# Altium project AMC_FMC_Carrier.PrjPcb (part 1 of 9)
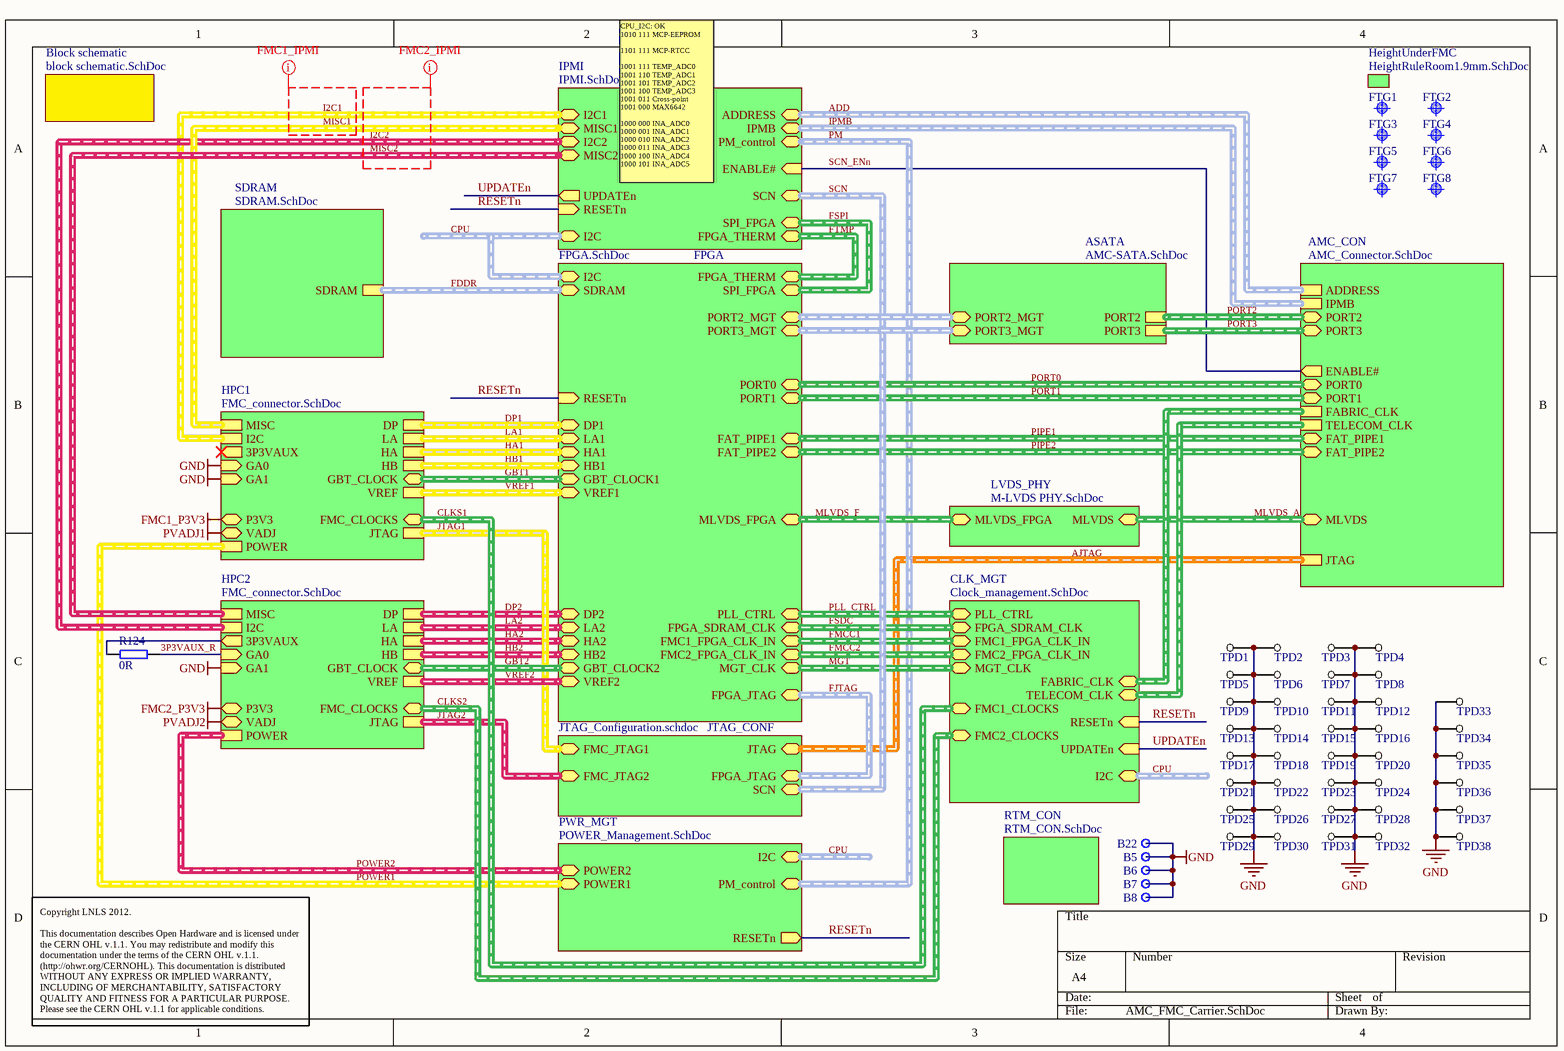
[diagram p0: AMC_FMC_Carrier.SchDoc]
25 sheets, 1216 parts. Net scope: hierarchical (ports join the sheet entries above them; power ports are global).
Board file: AMC_FMC_Carrier_35u_tears.PcbDoc
Sheets:
  AMC_FMC_Carrier.SchDoc
    HPC1 = FMC_connector.SchDoc
    HPC2 = FMC_connector.SchDoc
    FPGA = FPGA.SchDoc
      FSDRAM = FPGA_SDRAM.SchDoc
      FHPC1 = FMC_HPC1.SchDoc
      FHPC2 = FMC_HPC2.SchDoc
      FMGT = FPGA_MGT.SchDoc
      FPGA_SUP = FPGA_SUP.SchDoc
    SDRAM = SDRAM.SchDoc
    IPMI = IPMI.SchDoc
      CPU = CPU.SchDoc
      UUART = USB_UART.SchDoc
    JTAG_CONF = JTAG_Configuration.SchDoc
    LVDS_PHY = M-LVDS PHY.SchDoc
    CLK_MGT = Clock_management.SchDoc
      CLK_WR = Clock_WR.SchDoc
      FCLK = FMC_Clocks.SchDoc
    ASATA = AMC-SATA.SchDoc
    Block schematic = block schematic.SchDoc
    HeightUnderFMC = HeightRuleRoom1.9mm.SchDoc
  SUP_1.2_1.8.SchDoc
  SUP_3.3_FMC.SchDoc
  SUP_1V.SchDoc
  SUP_2.5_FMC.SchDoc
  UI_mon.SchDoc

## Sheet AMC_FMC_Carrier.SchDoc
size A4; DocumentNumber: 2; SheetNumber: 2; SheetTotal: 30

### Parts
B5  Test Point  [VERO_20-2136]  (value not drawn)
B6  Test Point  [VERO_20-2136]  (value not drawn)
B7  Test Point  [VERO_20-2136]  (value not drawn)
B8  Test Point  [VERO_20-2136]  (value not drawn)
B22  Test Point  [VERO_20-2136]  (value not drawn)
FTG1  Use only in PCB  [FIDUCIAL_TOP_S100-200]  (value not drawn)
FTG2  Use only in PCB  [FIDUCIAL_TOP_C100-200]  (value not drawn)
FTG3  Use only in PCB  [FIDUCIAL_TOP_S100-200]  (value not drawn)
FTG4  Use only in PCB  [FIDUCIAL_TOP_C100-200]  (value not drawn)
FTG5  Use only in PCB  [FIDUCIAL_TOP_S100-200]  (value not drawn)
FTG6  Use only in PCB  [FIDUCIAL_TOP_C100-200]  (value not drawn)
FTG7  Use only in PCB  [FIDUCIAL_TOP_S100-200]  (value not drawn)
FTG8  Use only in PCB  [FIDUCIAL_TOP_C100-200]  (value not drawn)
R124  0R  [0402R]
TPD1  Test Point  [TP_DIFF_0805]  (value not drawn)
TPD2  Test Point  [TP_DIFF_0805]  (value not drawn)
TPD3  Test Point  [TP_DIFF_0805]  (value not drawn)
TPD4  Test Point  [TP_DIFF_0805]  (value not drawn)
TPD5  Test Point  [TP_DIFF_0805]  (value not drawn)
TPD6  Test Point  [TP_DIFF_0805]  (value not drawn)
TPD7  Test Point  [TP_DIFF_0805]  (value not drawn)
TPD8  Test Point  [TP_DIFF_0805]  (value not drawn)
TPD9  Test Point  [TP_DIFF_0805]  (value not drawn)
TPD10  Test Point  [TP_DIFF_0805]  (value not drawn)
TPD11  Test Point  [TP_DIFF_0805]  (value not drawn)
TPD12  Test Point  [TP_DIFF_0805]  (value not drawn)
TPD13  Test Point  [TP_DIFF_0805]  (value not drawn)
TPD14  Test Point  [TP_DIFF_0805]  (value not drawn)
TPD15  Test Point  [TP_DIFF_0805]  (value not drawn)
TPD16  Test Point  [TP_DIFF_0805]  (value not drawn)
TPD17  Test Point  [TP_DIFF_0805]  (value not drawn)
TPD18  Test Point  [TP_DIFF_0805]  (value not drawn)
TPD19  Test Point  [TP_DIFF_0805]  (value not drawn)
TPD20  Test Point  [TP_DIFF_0805]  (value not drawn)
TPD21  Test Point  [TP_DIFF_0805]  (value not drawn)
TPD22  Test Point  [TP_DIFF_0805]  (value not drawn)
TPD23  Test Point  [TP_DIFF_0805]  (value not drawn)
TPD24  Test Point  [TP_DIFF_0805]  (value not drawn)
TPD25  Test Point  [TP_DIFF_0805]  (value not drawn)
TPD26  Test Point  [TP_DIFF_0805]  (value not drawn)
TPD27  Test Point  [TP_DIFF_0805]  (value not drawn)
TPD28  Test Point  [TP_DIFF_0805]  (value not drawn)
TPD29  Test Point  [TP_DIFF_0805]  (value not drawn)
TPD30  Test Point  [TP_DIFF_0805]  (value not drawn)
TPD31  Test Point  [TP_DIFF_0805]  (value not drawn)
TPD32  Test Point  [TP_DIFF_0805]  (value not drawn)
TPD33  Test Point  [TP_DIFF_0805]  (value not drawn)
TPD34  Test Point  [TP_DIFF_0805]  (value not drawn)
TPD35  Test Point  [TP_DIFF_0805]  (value not drawn)
TPD36  Test Point  [TP_DIFF_0805]  (value not drawn)
TPD37  Test Point  [TP_DIFF_0805]  (value not drawn)
TPD38  Test Point  [TP_DIFF_0805]  (value not drawn)

### Sub-sheets
AMC_CON = AMC_Connector.SchDoc (file not in this document): JTAG (harness AMC_JTAG), TELECOM_CLK (harness AMC_TELECOM_CLOCK), ADDRESS (harness AMC_ADD), FABRIC_CLK (harness AMC_FABRIC_CLOCK), IPMB (harness I2C), ENABLE# (out), PORT0 (harness PORT0), PORT1 (harness PORT1), PORT2 (harness PORT2), PORT3 (harness PORT3), FAT_PIPE1 (harness FAT_PIPE1), FAT_PIPE2 (harness FAT_PIPE2), MLVDS (harness MLVDS)
ASATA = AMC-SATA.SchDoc: PORT2 (harness PORT2), PORT3 (harness PORT3), PORT2_MGT (harness PORT2), PORT3_MGT (harness PORT3)
Block schematic = block schematic.SchDoc: no entries
CLK_MGT = Clock_management.SchDoc: FABRIC_CLK (harness AMC_FABRIC_CLOCK), TELECOM_CLK (harness AMC_TELECOM_CLOCK), FMC1_CLOCKS (harness FMC_CLOCKS), FMC2_CLOCKS (harness FMC_CLOCKS), MGT_CLK (harness MGT_CLK), FMC1_FPGA_CLK_IN (harness FMC_FPGA_CLK_IN), FMC2_FPGA_CLK_IN (harness FMC_FPGA_CLK_IN), FPGA_SDRAM_CLK (harness FPGA_SDRAM_CLK), PLL_CTRL (harness PLL_CTRL), RESETn (in), UPDATEn (in), I2C (harness I2C)
FPGA = FPGA.SchDoc: SDRAM (harness DDR), FPGA_JTAG (harness FMC_J1_JTAG), VREF2 (harness FMC_J1_VREF), VREF1 (harness FMC_J1_VREF), FPGA_THERM (harness FPGA_THERM), SPI_FPGA (harness SPI), FAT_PIPE1, FAT_PIPE2, PORT1, PORT0, MLVDS_FPGA, GBT_CLOCK1, GBT_CLOCK2, MGT_CLK, FMC1_FPGA_CLK_IN, FMC2_FPGA_CLK_IN, FPGA_SDRAM_CLK, PLL_CTRL (harness PLL_CTRL), RESETn (in), I2C (harness I2C), LA1, HA1, HB1, LA2, HA2, HB2, DP1, DP2, PORT2_MGT, PORT3_MGT
HeightUnderFMC = HeightRuleRoom1.9mm.SchDoc: no entries
HPC1 = FMC_connector.SchDoc: DP (harness FMC_J1_DP), LA (harness FMC_J1_LA), HA (harness FMC_J1_HA), HB (harness FMC_J1_HB), MISC (harness MISC), POWER (harness FMC_J1_POWER), JTAG (harness FMC_J1_JTAG), I2C (harness I2C), GA0 (in), GA1 (in), 3P3VAUX (out), VREF (harness FMC_J1_VREF), FMC_CLOCKS (harness FMC_CLOCKS), GBT_CLOCK (harness GBT_CLOCK), VADJ, P3V3
HPC2 = FMC_connector.SchDoc: DP (harness FMC_J1_DP), LA (harness FMC_J1_LA), HA (harness FMC_J1_HA), HB (harness FMC_J1_HB), MISC (harness MISC), POWER (harness FMC_J1_POWER), JTAG (harness FMC_J1_JTAG), I2C (harness I2C), VREF (harness FMC_J1_VREF), GA0 (in), GA1 (in), 3P3VAUX (out), FMC_CLOCKS (harness FMC_CLOCKS), GBT_CLOCK (harness GBT_CLOCK), VADJ, P3V3
IPMI = IPMI.SchDoc: I2C1 (harness I2C), I2C2 (harness I2C), IPMB (harness I2C), ADDRESS (harness AMC_ADD), MISC1 (harness MISC), MISC2 (harness MISC), PM_control (harness pm_control), FPGA_THERM (harness FPGA_THERM), SPI_FPGA (harness SPI), ENABLE# (in), UPDATEn (out), RESETn (in), I2C (harness I2C), SCN (harness SCN)
JTAG_CONF = JTAG_Configuration.schdoc: FMC_JTAG1 (harness FMC_J1_JTAG), FMC_JTAG2 (harness FMC_J1_JTAG), JTAG (harness AMC_JTAG), FPGA_JTAG (harness FMC_J1_JTAG), SCN (harness SCN)
LVDS_PHY = M-LVDS PHY.SchDoc: MLVDS (harness MLVDS), MLVDS_FPGA (harness MLVDS-FPGA)
PWR_MGT = POWER_Management.SchDoc (file not in this document): POWER1 (harness FMC_J1_POWER), POWER2 (harness FMC_J1_POWER), PM_control (harness PM_control), RESETn (out), I2C (harness I2C)
RTM_CON = RTM_CON.SchDoc (file not in this document): no entries
SDRAM = SDRAM.SchDoc: SDRAM (harness DDR)

### Nets
GND: B5.1 B6.1 B7.1 B8.1 B22.1 TPD1.1(TP) TPD2.1(TP) TPD3.1(TP) TPD4.1(TP) TPD5.1(TP) TPD6.1(TP) TPD7.1(TP) TPD8.1(TP) TPD9.1(TP) TPD10.1(TP) TPD11.1(TP) TPD12.1(TP) TPD13.1(TP) TPD14.1(TP) TPD15.1(TP) TPD16.1(TP) TPD17.1(TP) TPD18.1(TP) TPD19.1(TP) TPD20.1(TP) TPD21.1(TP) TPD22.1(TP) TPD23.1(TP) TPD24.1(TP) TPD25.1(TP) TPD26.1(TP) TPD27.1(TP) TPD28.1(TP) TPD29.1(TP) TPD30.1(TP) TPD31.1(TP) TPD32.1(TP) TPD33.1(TP) TPD34.1(TP) TPD35.1(TP) TPD36.1(TP) TPD37.1(TP) TPD38.1(TP) ; sheet HPC1/GA0, sheet HPC1/GA1, sheet HPC2/GA1
3P3VAUX_R: R124.2 ; sheet HPC2/GA0
POWER2.3P3VAUX: R124.1 ; sheet HPC2/3P3VAUX
RESETn: sheet FPGA/RESETn, sheet PWR_MGT/RESETn, sheet IPMI/RESETn, sheet CLK_MGT/RESETn
SCN_ENn: sheet AMC_CON/ENABLE#, sheet IPMI/ENABLE#
UPDATEn: sheet IPMI/UPDATEn, sheet CLK_MGT/UPDATEn

### Buses and harness runs
harness ADD = sheet AMC_CON/ADDRESS = sheet IPMI/ADDRESS
harness AJTAG = sheet AMC_CON/JTAG = sheet JTAG_CONF/JTAG
harness CLKS1 = sheet CLK_MGT/FMC1_CLOCKS = sheet HPC1/FMC_CLOCKS
harness CLKS2 = sheet CLK_MGT/FMC2_CLOCKS = sheet HPC2/FMC_CLOCKS
harness CPU = sheet CLK_MGT/I2C
harness CPU = sheet FPGA/I2C = sheet IPMI/I2C
harness CPU = sheet PWR_MGT/I2C
harness DP1 = sheet FPGA/DP1 = sheet HPC1/DP
harness DP2 = sheet FPGA/DP2 = sheet HPC2/DP
harness FDDR = sheet FPGA/SDRAM = sheet SDRAM/SDRAM
harness FJTAG = sheet FPGA/FPGA_JTAG = sheet JTAG_CONF/FPGA_JTAG
harness FMCC1 = sheet CLK_MGT/FMC1_FPGA_CLK_IN = sheet FPGA/FMC1_FPGA_CLK_IN
harness FMCC2 = sheet CLK_MGT/FMC2_FPGA_CLK_IN = sheet FPGA/FMC2_FPGA_CLK_IN
harness FSDC = sheet CLK_MGT/FPGA_SDRAM_CLK = sheet FPGA/FPGA_SDRAM_CLK
harness FSPI = sheet FPGA/SPI_FPGA = sheet IPMI/SPI_FPGA
harness FTMP = sheet FPGA/FPGA_THERM = sheet IPMI/FPGA_THERM
harness GBT1 = sheet FPGA/GBT_CLOCK1 = sheet HPC1/GBT_CLOCK
harness GBT2 = sheet FPGA/GBT_CLOCK2 = sheet HPC2/GBT_CLOCK
harness HA1 = sheet FPGA/HA1 = sheet HPC1/HA
harness HA2 = sheet FPGA/HA2 = sheet HPC2/HA
harness HB1 = sheet FPGA/HB1 = sheet HPC1/HB
harness HB2 = sheet FPGA/HB2 = sheet HPC2/HB
harness I2C1 = sheet HPC1/I2C = sheet IPMI/I2C1
harness I2C2 = sheet HPC2/I2C = sheet IPMI/I2C2
harness IPMB = sheet AMC_CON/IPMB = sheet IPMI/IPMB
harness JTAG1 = sheet HPC1/JTAG = sheet JTAG_CONF/FMC_JTAG1
harness JTAG2 = sheet HPC2/JTAG = sheet JTAG_CONF/FMC_JTAG2
harness LA1 = sheet FPGA/LA1 = sheet HPC1/LA
harness LA2 = sheet FPGA/LA2 = sheet HPC2/LA
harness MGT = sheet CLK_MGT/MGT_CLK = sheet FPGA/MGT_CLK
harness MISC1 = sheet HPC1/MISC = sheet IPMI/MISC1
harness MISC2 = sheet HPC2/MISC = sheet IPMI/MISC2
harness MLVDS_A = sheet AMC_CON/MLVDS = sheet LVDS_PHY/MLVDS
harness MLVDS_F = sheet FPGA/MLVDS_FPGA = sheet LVDS_PHY/MLVDS_FPGA
harness PIPE1 = sheet AMC_CON/FAT_PIPE1 = sheet FPGA/FAT_PIPE1
harness PIPE2 = sheet AMC_CON/FAT_PIPE2 = sheet FPGA/FAT_PIPE2
harness PLL_CTRL = sheet CLK_MGT/PLL_CTRL = sheet FPGA/PLL_CTRL
harness PM = sheet IPMI/PM_control = sheet PWR_MGT/PM_control
harness PORT0 = sheet AMC_CON/PORT0 = sheet FPGA/PORT0
harness PORT1 = sheet AMC_CON/PORT1 = sheet FPGA/PORT1
harness PORT2 = sheet AMC_CON/PORT2 = sheet ASATA/PORT2
harness PORT3 = sheet AMC_CON/PORT3 = sheet ASATA/PORT3
harness POWER1 = sheet HPC1/POWER = sheet PWR_MGT/POWER1
harness POWER2 = sheet HPC2/POWER = sheet PWR_MGT/POWER2
harness SCN = sheet IPMI/SCN = sheet JTAG_CONF/SCN
harness sheet AMC_CON/FABRIC_CLK = sheet CLK_MGT/FABRIC_CLK
harness sheet AMC_CON/TELECOM_CLK = sheet CLK_MGT/TELECOM_CLK
harness sheet ASATA/PORT2_MGT = sheet FPGA/PORT2_MGT
harness sheet ASATA/PORT3_MGT = sheet FPGA/PORT3_MGT
harness VREF1 = sheet FPGA/VREF1 = sheet HPC1/VREF
harness VREF2 = sheet FPGA/VREF2 = sheet HPC2/VREF

### Layout directives
net class FMC1_IPMI: I2C1, MISC1
net class FMC2_IPMI: I2C2, MISC2

### Notes on the sheet
- CPU_I2C: OK
  1010 111 MCP-EEPROM
  1101 111 MCP-RTCC
  1001 111 TEMP_ADC0
  1001 110 TEMP_ADC1
  1001 101 TEMP_ADC2
  1001 100 TEMP_ADC3
  1001 011 Cross-point
  1001 000 MAX6642
  1000 000 INA_ADC0
  1000 001 INA_ADC1
  1000 010 INA_ADC2
  1000 011 INA_ADC3
  1000 100 INA_ADC4
  1000 101 INA_ADC5
- Copyright LNLS 2012.
  This documentation describes Open Hardware and is licensed under the CERN OHL v.1.1. You may redistribute and modify this documentation under the terms of the CERN OHL v.1.1. (http://ohwr.org/CERNOHL). This documentation is distributed WITHOUT ANY EXPRESS OR IMPLIED WARRANTY, INCLUDING OF MERCHANTABILITY, SATISFACTORY QUALITY AND FITNESS FOR A PARTICULAR PURPOSE. Please see the CERN OHL v.1.1 for applicable conditions.

### Library data of the parts
B5-B8 B22 = VERO_20-2136: Single Terminal Socket; Part Description: Black Bead PCB Terminal Test Pin (1.32 mm hole); Manufacturer: VERO TECHNOLOGIES; Table: Miscellaneous; Part Number: VERO_20-2136; Component Kind: Standard; Component Type: Standard; Pin Count: 1; Family: Test Point; Mounted: Yes; Socket: No; SMD: No; Status: None; Manufacturer Part Number: 20-2136; ComponentHeight: 5.3mm; HelpURL: \\cern.ch\dfs\Applications\Altium\Datasheets\VERO_20-2136.pdf; Author: CERN DEM JLC; CreateDate: 21/07/2008; LatestRevisionDate: 21/07/2008
FTG1 FTG3 FTG5 FTG7 = FIDUCIAL_TARGET_S100-200: Fiducial Target; Part Description: Square Fiducial Target, Top Layer, 1.0mm, Top Solder 2.0mm, Keepout =2.0mm; Mounted: No; Table: Pads; Part Number: FIDUCIAL_TARGET_S100-200; Component Kind: Standard (No BOM); Component Type: Standard (No BOM); Pin Count: 1; Family: Fiducial; Socket: No; SMD: Yes; Status: None; ComponentHeight: 0mm; Author: CERN DEM JLC; CreateDate: 2010-02-09; LatestRevisionDate: 2012-04-04; PackageDescription: Square Fiducial Target, Top Layer, 1.0mm, Top Solder 2.0mm, Keepout =2.0mm
FTG2 FTG4 FTG6 FTG8 = FIDUCIAL_TARGET_C100-200: Fiducial Target; Part Description: Round Fiducial Target, Top Layer, 1.0mm, Top Solder 2.0mm, Keepout =2.0mm; Mounted: No; Table: Pads; Part Number: FIDUCIAL_TARGET_C100-200; Component Kind: Standard (No BOM); Component Type: Standard (No BOM); Pin Count: 1; Family: Fiducial; Socket: No; SMD: Yes; Status: None; ComponentHeight: 0mm; Author: CERN DEM JLC; CreateDate: 2010-02-09; LatestRevisionDate: 2012-04-04; PackageDescription: Round Fiducial Target, Top Layer, 1.0mm, Top Solder 2.0mm, Keepout =2.0mm
R124 = RES_0402: SMD Resistor; Supplier 1: Newark; Supplier Part Number 1: 59M6691
TPD1-TPD38 = TP_DIFF: 1625854-2; Bottom_EstimationX (mm): 0; Document Name: AMC_FMC_Carrier.SchDoc; Part Number: TP_DIFF; ParamsList: Test Point; FootprintSizeX (mm): 4; FootprintSizeY (mm): 2; FootprintRectangleArea (mm): 8; Thickness (Max) (mm): 2; Bottom_EstimationY (mm): 0; Bottom_Area_Estimation (mm): 0; FootprintAlias: TP_SMD_0805

## Sheet FMC_connector.SchDoc
size A2; DocumentNumber: 3; SheetNumber: 3; SheetTotal: 30
Used 2 times, as channels HPC1, HPC2. Parts and nets are listed once, with the designators drawn on the sheet.
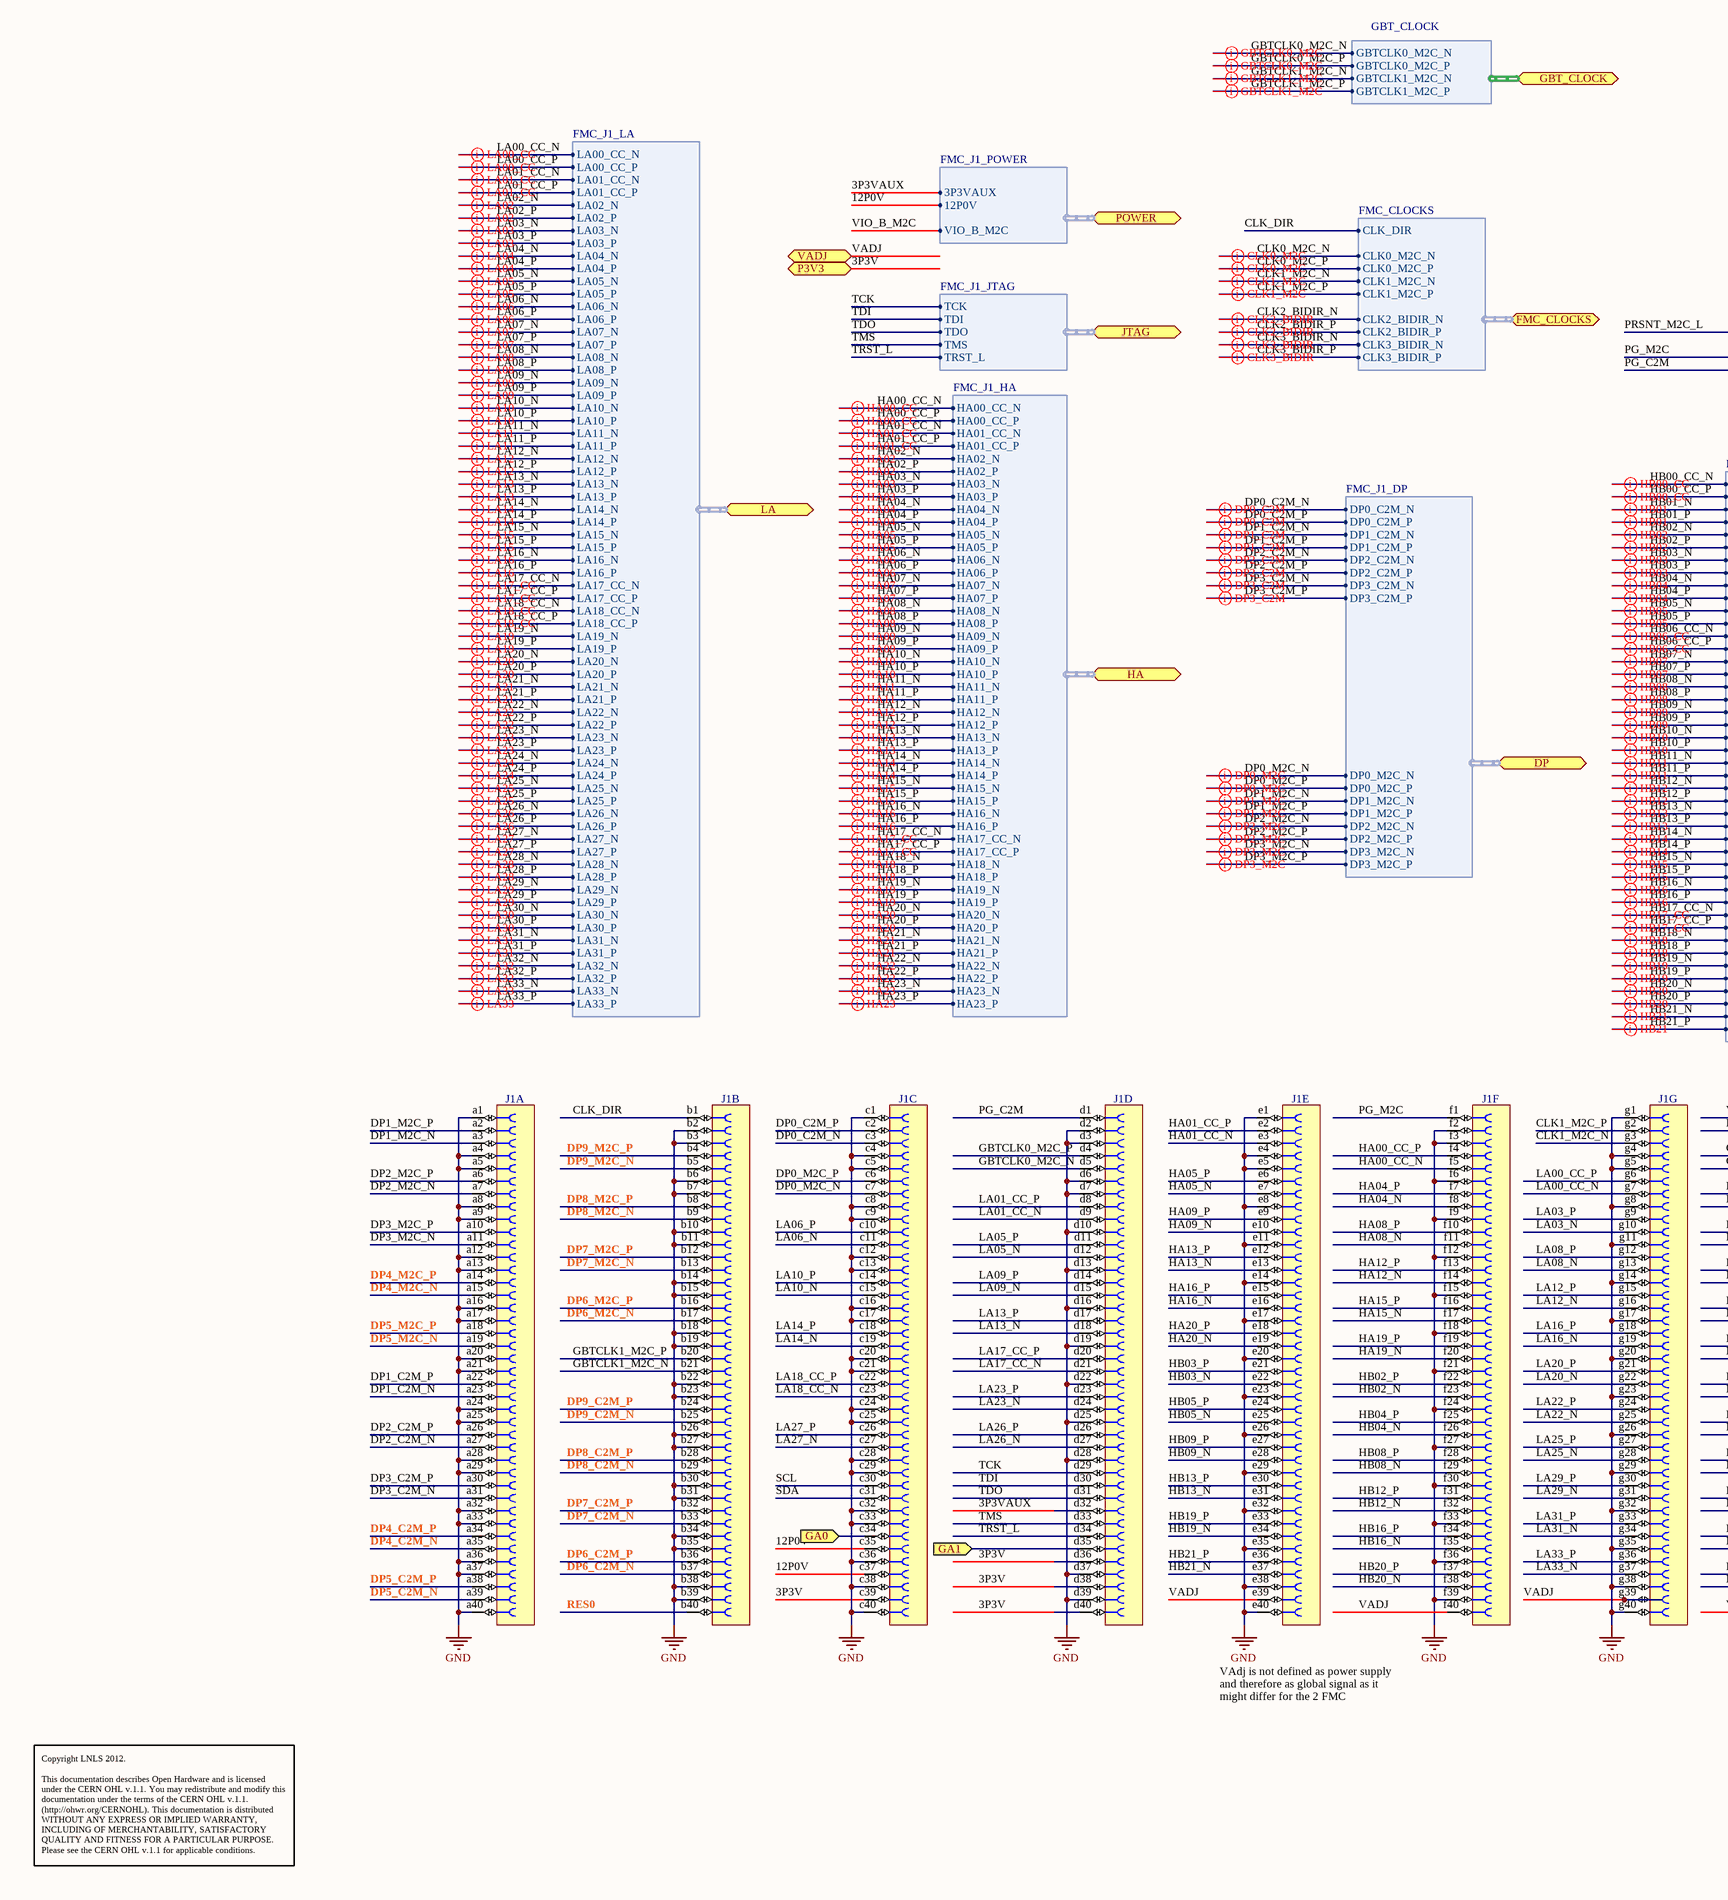
[diagram p1: FMC_connector.SchDoc, left]
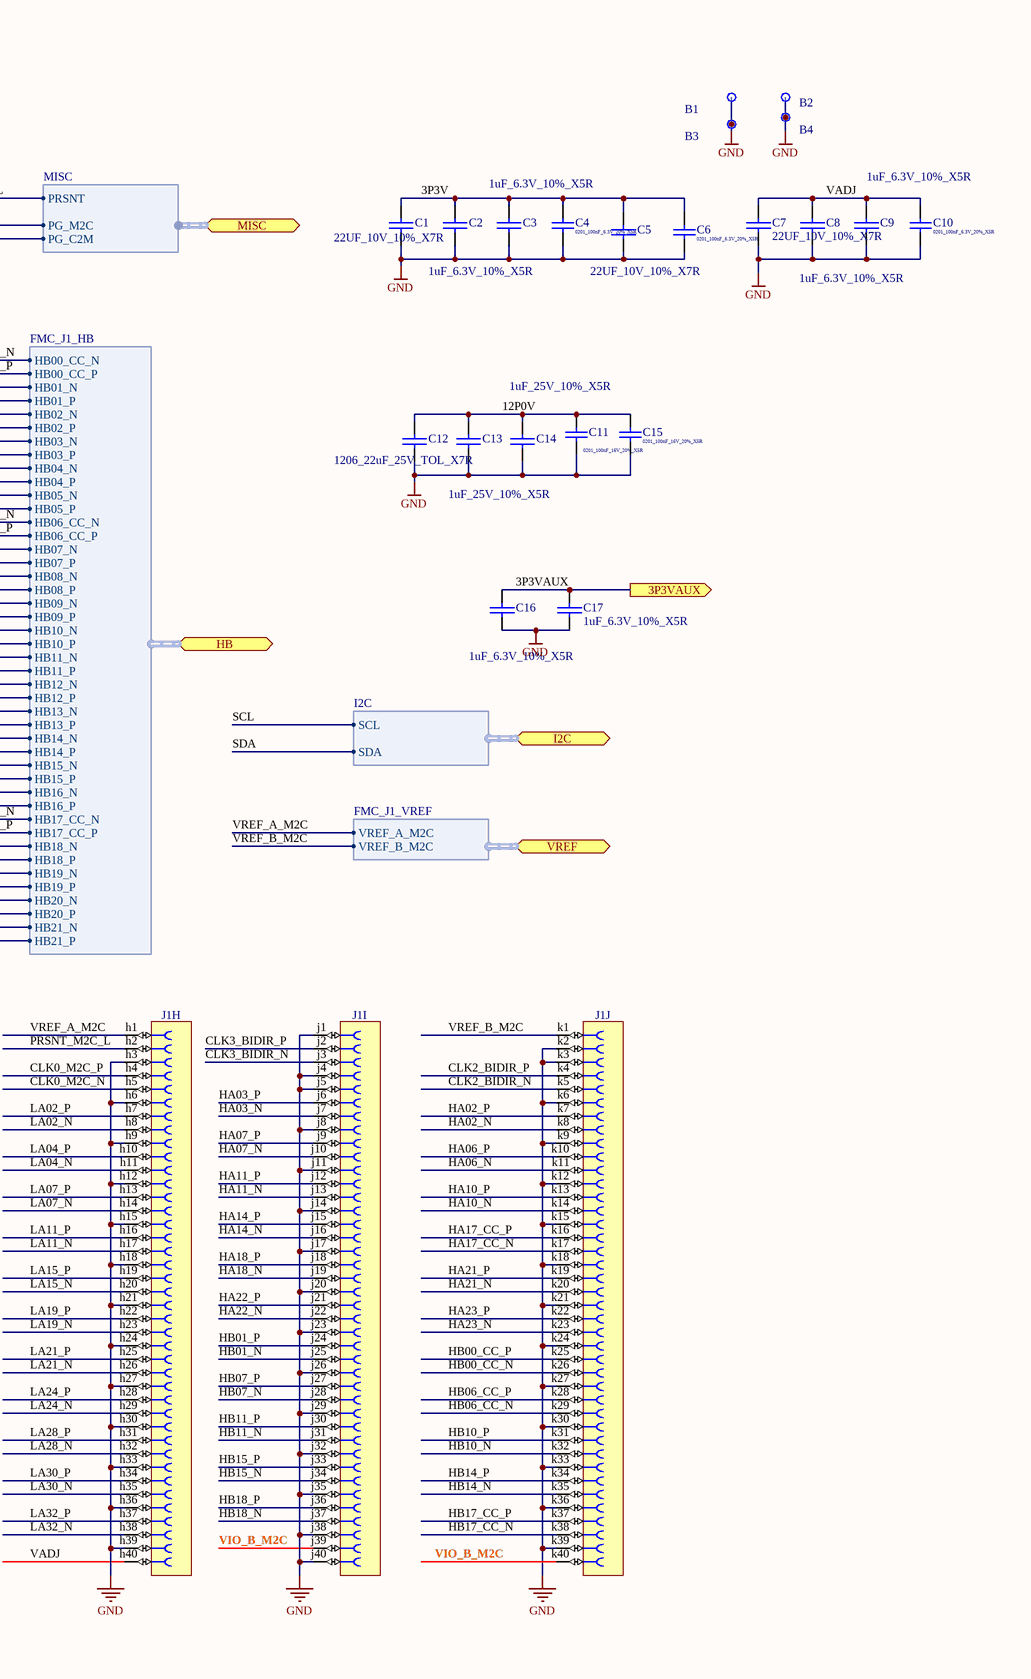
[diagram p2: FMC_connector.SchDoc, right]

### Parts
B1  Plated Hole  [MTG270_500]  (value not drawn)
B2  Plated Hole  [MTG270_500]  (value not drawn)
B3  Plated Hole  [MTG270_500]  (value not drawn)
B4  Plated Hole  [MTG270_500]  (value not drawn)
C1  22UF_10V_10%_X7R  [1206C]
C2  1uF_6.3V_10%_X5R  [0603C]
C3  1uF_6.3V_10%_X5R  [0603C]
C4  0201_100nF_6.3V_20%_X5R  [CAPC0603X33N]
C5  22UF_10V_10%_X7R  [1206C]
C6  0201_100nF_6.3V_20%_X5R  [CAPC0603X33N]
C7  22UF_10V_10%_X7R  [1206C]
C8  1uF_6.3V_10%_X5R  [0603C]
C9  1uF_6.3V_10%_X5R  [0603C]
C10  0201_100nF_6.3V_20%_X5R  [CAPC0603X33N]
C11  0201_100nF_16V_20%_X5R  [CAPC0603X33N]
C12  1206_22uF_25V_TOL_X7R  [1206C]
C13  1uF_25V_10%_X5R  [0603C]
C14  1uF_25V_10%_X5R  [0603C]
C15  0201_100nF_16V_20%_X5R  [CAPC0603X33N]
C16  1uF_6.3V_10%_X5R  [0603C]
C17  1uF_6.3V_10%_X5R  [0603C]
J1  VITA 57  [SAMTEC_ASP-134486-01]  (value not drawn)  (parts A,B,C,D,E,F,G,H,I,J of 10)

### Ports
3P3VAUX (out), DP (harness FMC_J1_DP), FMC_CLOCKS (harness FMC_CLOCKS), GA0 (in), GA1 (in), GBT_CLOCK (harness GBT_CLOCK), HA (harness FMC_J1_HA), HB (harness FMC_J1_HB), I2C (harness I2C), JTAG (harness FMC_J1_JTAG), LA (harness FMC_J1_LA), MISC (harness MISC), P3V3, POWER (harness FMC_J1_POWER), VADJ, VREF (harness FMC_J1_VREF)

### Harnesses
FMC_J1_DP: DP1_C2M_N, DP1_C2M_P, DP1_M2C_N, DP1_M2C_P, DP2_C2M_N, DP2_C2M_P, DP2_M2C_N, DP2_M2C_P, DP3_C2M_N, DP3_C2M_P, DP3_M2C_N, DP3_M2C_P, DP0_C2M_N, DP0_C2M_P, DP0_M2C_N, DP0_M2C_P
FMC_J1_LA: LA05_N, LA05_P, LA06_N, LA06_P, LA09_N, LA09_P, LA10_N, LA10_P, LA13_N, LA13_P, LA14_N, LA14_P, LA23_N, LA23_P, LA26_N, LA26_P, LA27_N, LA27_P, LA02_N, LA02_P, LA03_N, LA03_P, LA04_N, LA04_P, LA07_N, LA07_P, LA08_N, LA08_P, LA11_N, LA11_P, LA12_N, LA12_P, LA15_N, LA15_P, LA16_N, LA16_P, LA19_N, LA19_P, LA20_N, LA20_P, LA21_N, LA21_P, LA22_N, LA22_P, LA24_N, LA24_P, LA25_N, LA25_P, LA28_N, LA28_P, LA29_N, LA29_P, LA30_N, LA30_P, LA31_N, LA31_P, LA32_N, LA32_P, LA33_N, LA33_P, LA00_CC_N, LA00_CC_P, LA01_CC_N, LA01_CC_P, LA17_CC_N, LA17_CC_P, LA18_CC_N, LA18_CC_P
FMC_J1_HA: HA04_N, HA04_P, HA05_N, HA05_P, HA08_N, HA08_P, HA09_N, HA09_P, HA12_N, HA12_P, HA13_N, HA13_P, HA15_N, HA15_P, HA16_N, HA16_P, HA19_N, HA19_P, HA20_N, HA20_P, HA02_N, HA02_P, HA03_N, HA03_P, HA06_N, HA06_P, HA07_N, HA07_P, HA10_N, HA10_P, HA11_N, HA11_P, HA14_N, HA14_P, HA18_N, HA18_P, HA21_N, HA21_P, HA22_N, HA22_P, HA23_N, HA23_P, HA17_CC_N, HA17_CC_P, HA00_CC_N, HA00_CC_P, HA01_CC_N, HA01_CC_P
FMC_J1_HB: HB02_N, HB02_P, HB03_N, HB03_P, HB04_N, HB04_P, HB05_N, HB05_P, HB08_N, HB08_P, HB09_N, HB09_P, HB12_N, HB12_P, HB13_N, HB13_P, HB16_N, HB16_P, HB19_N, HB19_P, HB20_N, HB20_P, HB21_N, HB21_P, HB01_N, HB01_P, HB07_N, HB07_P, HB10_N, HB10_P, HB11_N, HB11_P, HB14_N, HB14_P, HB15_N, HB15_P, HB18_N, HB18_P, HB17_CC_N, HB17_CC_P, HB06_CC_N, HB06_CC_P, HB00_CC_N, HB00_CC_P
FMC_J1_POWER: 3P3VAUX, 12P0V, VIO_B_M2C
FMC_J1_JTAG: TCK, TDI, TDO, TMS, TRST_L
I2C: SCL, SDA
FMC_CLOCKS: CLK2_BIDIR_N, CLK2_BIDIR_P, CLK3_BIDIR_N, CLK3_BIDIR_P, CLK0_M2C_N, CLK0_M2C_P, CLK1_M2C_N, CLK1_M2C_P, CLK_DIR
FMC_J1_VREF: VREF_A_M2C, VREF_B_M2C
GBT_CLOCK: GBTCLK0_M2C_N, GBTCLK0_M2C_P, GBTCLK1_M2C_N, GBTCLK1_M2C_P
MISC: PRSNT, PG_M2C, PG_C2M

### Nets
GND: B1.1 B2.1 B3.1 B4.1 C1.2 C2.2 C3.2 C4.1 C5.2 C6.1 C7.2 C8.2 C9.2 C10.1 C11.1 C12.2 C13.2 C14.2 C15.1 C16.2 C17.2 J1.a1 J1.a4 J1.a5 J1.a8 J1.a9 J1.a12 J1.a13 J1.a16 J1.a17 J1.a20 J1.a21 J1.a24 J1.a25 J1.a28 J1.a29 J1.a32 J1.a33 J1.a36 J1.a37 J1.a40 J1.b2 J1.b3 J1.b6 J1.b7 J1.b10 J1.b11 J1.b14 J1.b15 J1.b18 J1.b19 J1.b22 J1.b23 J1.b26 J1.b27 J1.b30 J1.b31 J1.b34 J1.b35 J1.b38 J1.b39 J1.c1 J1.c4 J1.c5 J1.c8 J1.c9 J1.c12 J1.c13 J1.c16 J1.c17 J1.c20 J1.c21 J1.c24 J1.c25 J1.c28 J1.c29 J1.c32 J1.c33 J1.c36 J1.c38 J1.c40 J1.d2 J1.d3 J1.d6 J1.d7 J1.d10 J1.d13 J1.d16 J1.d19 J1.d22 J1.d25 J1.d28 J1.d37 J1.d39 J1.e1 J1.e4 J1.e5 J1.e8 J1.e11 J1.e14 J1.e17 J1.e20 J1.e23 J1.e26 J1.e29 J1.e32 J1.e35 J1.e38 J1.e40 J1.f2 J1.f3 J1.f6 J1.f9 J1.f12 J1.f15 J1.f18 J1.f21 J1.f24 J1.f27 J1.f30 J1.f33 J1.f36 J1.f39 J1.g1 J1.g4 J1.g5 J1.g8 J1.g11 J1.g14 J1.g17 J1.g20 J1.g23 J1.g26 J1.g29 J1.g32 J1.g35 J1.g38 J1.g40 J1.h3 J1.h6 J1.h9 J1.h12 J1.h15 J1.h18 J1.h21 J1.h24 J1.h27 J1.h30 J1.h33 J1.h36 J1.h39 J1.j1 J1.j4 J1.j5 J1.j8 J1.j11 J1.j14 J1.j17 J1.j20 J1.j23 J1.j26 J1.j29 J1.j32 J1.j35 J1.j38 J1.j40 J1.k2 J1.k3 J1.k6 J1.k9 J1.k12 J1.k15 J1.k18 J1.k21 J1.k24 J1.k27 J1.k30 J1.k33 J1.k36 J1.k39
3P3V: C1.1 C2.1 C3.1 C4.2 C5.1 C6.2 J1.c39 J1.d36 J1.d38 J1.d40 ; port P3V3
3P3VAUX: C16.1 C17.1 J1.d32 ; port 3P3VAUX, port POWER.3P3VAUX
12P0V: C11.2 C12.1 C13.1 C14.1 C15.2 J1.c35 J1.c37 ; port POWER.12P0V
CLK0_M2C_N: J1.h5 ; port FMC_CLOCKS.CLK0_M2C_N
CLK0_M2C_P: J1.h4 ; port FMC_CLOCKS.CLK0_M2C_P
CLK1_M2C_N: J1.g3 ; port FMC_CLOCKS.CLK1_M2C_N
CLK1_M2C_P: J1.g2 ; port FMC_CLOCKS.CLK1_M2C_P
CLK2_BIDIR_N: J1.k5 ; port FMC_CLOCKS.CLK2_BIDIR_N
CLK2_BIDIR_P: J1.k4 ; port FMC_CLOCKS.CLK2_BIDIR_P
CLK3_BIDIR_N: J1.j3 ; port FMC_CLOCKS.CLK3_BIDIR_N
CLK3_BIDIR_P: J1.j2 ; port FMC_CLOCKS.CLK3_BIDIR_P
CLK_DIR: J1.b1 ; port FMC_CLOCKS.CLK_DIR
DP0_C2M_N: J1.c3 ; port DP.DP0_C2M_N
DP0_C2M_P: J1.c2 ; port DP.DP0_C2M_P
DP0_M2C_N: J1.c7 ; port DP.DP0_M2C_N
DP0_M2C_P: J1.c6 ; port DP.DP0_M2C_P
DP1_C2M_N: J1.a23 ; port DP.DP1_C2M_N
DP1_C2M_P: J1.a22 ; port DP.DP1_C2M_P
DP1_M2C_N: J1.a3 ; port DP.DP1_M2C_N
DP1_M2C_P: J1.a2 ; port DP.DP1_M2C_P
DP2_C2M_N: J1.a27 ; port DP.DP2_C2M_N
DP2_C2M_P: J1.a26 ; port DP.DP2_C2M_P
DP2_M2C_N: J1.a7 ; port DP.DP2_M2C_N
DP2_M2C_P: J1.a6 ; port DP.DP2_M2C_P
DP3_C2M_N: J1.a31 ; port DP.DP3_C2M_N
DP3_C2M_P: J1.a30 ; port DP.DP3_C2M_P
DP3_M2C_N: J1.a11 ; port DP.DP3_M2C_N
DP3_M2C_P: J1.a10 ; port DP.DP3_M2C_P
GA0: J1.c34 ; port GA0
GA1: J1.d35 ; port GA1
GBTCLK0_M2C_N: J1.d5 ; port GBT_CLOCK.GBTCLK0_M2C_N
GBTCLK0_M2C_P: J1.d4 ; port GBT_CLOCK.GBTCLK0_M2C_P
GBTCLK1_M2C_N: J1.b21 ; port GBT_CLOCK.GBTCLK1_M2C_N
GBTCLK1_M2C_P: J1.b20 ; port GBT_CLOCK.GBTCLK1_M2C_P
HA00_CC_N: J1.f5 ; port HA.HA00_CC_N
HA00_CC_P: J1.f4 ; port HA.HA00_CC_P
HA01_CC_N: J1.e3 ; port HA.HA01_CC_N
HA01_CC_P: J1.e2 ; port HA.HA01_CC_P
HA02_N: J1.k8 ; port HA.HA02_N
HA02_P: J1.k7 ; port HA.HA02_P
HA03_N: J1.j7 ; port HA.HA03_N
HA03_P: J1.j6 ; port HA.HA03_P
HA04_N: J1.f8 ; port HA.HA04_N
HA04_P: J1.f7 ; port HA.HA04_P
HA05_N: J1.e7 ; port HA.HA05_N
HA05_P: J1.e6 ; port HA.HA05_P
HA06_N: J1.k11 ; port HA.HA06_N
HA06_P: J1.k10 ; port HA.HA06_P
HA07_N: J1.j10 ; port HA.HA07_N
HA07_P: J1.j9 ; port HA.HA07_P
HA08_N: J1.f11 ; port HA.HA08_N
HA08_P: J1.f10 ; port HA.HA08_P
HA09_N: J1.e10 ; port HA.HA09_N
HA09_P: J1.e9 ; port HA.HA09_P
HA10_N: J1.k14 ; port HA.HA10_N
HA10_P: J1.k13 ; port HA.HA10_P
HA11_N: J1.j13 ; port HA.HA11_N
HA11_P: J1.j12 ; port HA.HA11_P
HA12_N: J1.f14 ; port HA.HA12_N
HA12_P: J1.f13 ; port HA.HA12_P
HA13_N: J1.e13 ; port HA.HA13_N
HA13_P: J1.e12 ; port HA.HA13_P
HA14_N: J1.j16 ; port HA.HA14_N
HA14_P: J1.j15 ; port HA.HA14_P
HA15_N: J1.f17 ; port HA.HA15_N
HA15_P: J1.f16 ; port HA.HA15_P
HA16_N: J1.e16 ; port HA.HA16_N
HA16_P: J1.e15 ; port HA.HA16_P
HA17_CC_N: J1.k17 ; port HA.HA17_CC_N
HA17_CC_P: J1.k16 ; port HA.HA17_CC_P
HA18_N: J1.j19 ; port HA.HA18_N
HA18_P: J1.j18 ; port HA.HA18_P
HA19_N: J1.f20 ; port HA.HA19_N
HA19_P: J1.f19 ; port HA.HA19_P
HA20_N: J1.e19 ; port HA.HA20_N
HA20_P: J1.e18 ; port HA.HA20_P
HA21_N: J1.k20 ; port HA.HA21_N
HA21_P: J1.k19 ; port HA.HA21_P
HA22_N: J1.j22 ; port HA.HA22_N
HA22_P: J1.j21 ; port HA.HA22_P
HA23_N: J1.k23 ; port HA.HA23_N
HA23_P: J1.k22 ; port HA.HA23_P
HB00_CC_N: J1.k26 ; port HB.HB00_CC_N
HB00_CC_P: J1.k25 ; port HB.HB00_CC_P
HB01_N: J1.j25 ; port HB.HB01_N
HB01_P: J1.j24 ; port HB.HB01_P
HB02_N: J1.f23 ; port HB.HB02_N
HB02_P: J1.f22 ; port HB.HB02_P
HB03_N: J1.e22 ; port HB.HB03_N
HB03_P: J1.e21 ; port HB.HB03_P
HB04_N: J1.f26 ; port HB.HB04_N
HB04_P: J1.f25 ; port HB.HB04_P
HB05_N: J1.e25 ; port HB.HB05_N
HB05_P: J1.e24 ; port HB.HB05_P
HB06_CC_N: J1.k29 ; port HB.HB06_CC_N
HB06_CC_P: J1.k28 ; port HB.HB06_CC_P
HB07_N: J1.j28 ; port HB.HB07_N
HB07_P: J1.j27 ; port HB.HB07_P
HB08_N: J1.f29 ; port HB.HB08_N
HB08_P: J1.f28 ; port HB.HB08_P
HB09_N: J1.e28 ; port HB.HB09_N
HB09_P: J1.e27 ; port HB.HB09_P
HB10_N: J1.k32 ; port HB.HB10_N
HB10_P: J1.k31 ; port HB.HB10_P
HB11_N: J1.j31 ; port HB.HB11_N
HB11_P: J1.j30 ; port HB.HB11_P
HB12_N: J1.f32 ; port HB.HB12_N
HB12_P: J1.f31 ; port HB.HB12_P
HB13_N: J1.e31 ; port HB.HB13_N
HB13_P: J1.e30 ; port HB.HB13_P
HB14_N: J1.k35 ; port HB.HB14_N
HB14_P: J1.k34 ; port HB.HB14_P
HB15_N: J1.j34 ; port HB.HB15_N
HB15_P: J1.j33 ; port HB.HB15_P
HB16_N: J1.f35 ; port HB.HB16_N
HB16_P: J1.f34 ; port HB.HB16_P
HB17_CC_N: J1.k38 ; port HB.HB17_CC_N
HB17_CC_P: J1.k37 ; port HB.HB17_CC_P
HB18_N: J1.j37 ; port HB.HB18_N
HB18_P: J1.j36 ; port HB.HB18_P
HB19_N: J1.e34 ; port HB.HB19_N
HB19_P: J1.e33 ; port HB.HB19_P
HB20_N: J1.f38 ; port HB.HB20_N
HB20_P: J1.f37 ; port HB.HB20_P
HB21_N: J1.e37 ; port HB.HB21_N
HB21_P: J1.e36 ; port HB.HB21_P
LA00_CC_N: J1.g7 ; port LA.LA00_CC_N
LA00_CC_P: J1.g6 ; port LA.LA00_CC_P
LA01_CC_N: J1.d9 ; port LA.LA01_CC_N
LA01_CC_P: J1.d8 ; port LA.LA01_CC_P
LA02_N: J1.h8 ; port LA.LA02_N
LA02_P: J1.h7 ; port LA.LA02_P
LA03_N: J1.g10 ; port LA.LA03_N
LA03_P: J1.g9 ; port LA.LA03_P
LA04_N: J1.h11 ; port LA.LA04_N
LA04_P: J1.h10 ; port LA.LA04_P
LA05_N: J1.d12 ; port LA.LA05_N
LA05_P: J1.d11 ; port LA.LA05_P
LA06_N: J1.c11 ; port LA.LA06_N
LA06_P: J1.c10 ; port LA.LA06_P
LA07_N: J1.h14 ; port LA.LA07_N
LA07_P: J1.h13 ; port LA.LA07_P
LA08_N: J1.g13 ; port LA.LA08_N
LA08_P: J1.g12 ; port LA.LA08_P
LA09_N: J1.d15 ; port LA.LA09_N
LA09_P: J1.d14 ; port LA.LA09_P
LA10_N: J1.c15 ; port LA.LA10_N
LA10_P: J1.c14 ; port LA.LA10_P
LA11_N: J1.h17 ; port LA.LA11_N
LA11_P: J1.h16 ; port LA.LA11_P
LA12_N: J1.g16 ; port LA.LA12_N
LA12_P: J1.g15 ; port LA.LA12_P
LA13_N: J1.d18 ; port LA.LA13_N
LA13_P: J1.d17 ; port LA.LA13_P
LA14_N: J1.c19 ; port LA.LA14_N
LA14_P: J1.c18 ; port LA.LA14_P
LA15_N: J1.h20 ; port LA.LA15_N
LA15_P: J1.h19 ; port LA.LA15_P
LA16_N: J1.g19 ; port LA.LA16_N
LA16_P: J1.g18 ; port LA.LA16_P
LA17_CC_N: J1.d21 ; port LA.LA17_CC_N
LA17_CC_P: J1.d20 ; port LA.LA17_CC_P
LA18_CC_N: J1.c23 ; port LA.LA18_CC_N
LA18_CC_P: J1.c22 ; port LA.LA18_CC_P
LA19_N: J1.h23 ; port LA.LA19_N
LA19_P: J1.h22 ; port LA.LA19_P
LA20_N: J1.g22 ; port LA.LA20_N
LA20_P: J1.g21 ; port LA.LA20_P
LA21_N: J1.h26 ; port LA.LA21_N
LA21_P: J1.h25 ; port LA.LA21_P
LA22_N: J1.g25 ; port LA.LA22_N
LA22_P: J1.g24 ; port LA.LA22_P
LA23_N: J1.d24 ; port LA.LA23_N
LA23_P: J1.d23 ; port LA.LA23_P
LA24_N: J1.h29 ; port LA.LA24_N
LA24_P: J1.h28 ; port LA.LA24_P
LA25_N: J1.g28 ; port LA.LA25_N
LA25_P: J1.g27 ; port LA.LA25_P
LA26_N: J1.d27 ; port LA.LA26_N
LA26_P: J1.d26 ; port LA.LA26_P
LA27_N: J1.c27 ; port LA.LA27_N
LA27_P: J1.c26 ; port LA.LA27_P
LA28_N: J1.h32 ; port LA.LA28_N
LA28_P: J1.h31 ; port LA.LA28_P
LA29_N: J1.g31 ; port LA.LA29_N
LA29_P: J1.g30 ; port LA.LA29_P
LA30_N: J1.h35 ; port LA.LA30_N
LA30_P: J1.h34 ; port LA.LA30_P
LA31_N: J1.g34 ; port LA.LA31_N
LA31_P: J1.g33 ; port LA.LA31_P
LA32_N: J1.h38 ; port LA.LA32_N
LA32_P: J1.h37 ; port LA.LA32_P
LA33_N: J1.g37 ; port LA.LA33_N
LA33_P: J1.g36 ; port LA.LA33_P
PG_C2M: J1.d1 ; port MISC.PG_C2M
PG_M2C: J1.f1 ; port MISC.PG_M2C
PRSNT_M2C_L: J1.h2 ; port MISC.PRSNT
SCL: J1.c30 ; port I2C.SCL
SDA: J1.c31 ; port I2C.SDA
TCK: J1.d29 ; port JTAG.TCK
TDI: J1.d30 ; port JTAG.TDI
TDO: J1.d31 ; port JTAG.TDO
TMS: J1.d33 ; port JTAG.TMS
TRST_L: J1.d34 ; port JTAG.TRST_L
VADJ: C7.1 C8.1 C9.1 C10.2 J1.e39 J1.f40 J1.g39 J1.h40 ; port VADJ
VIO_B_M2C: port POWER.VIO_B_M2C
VREF_A_M2C: J1.h1 ; port VREF.VREF_A_M2C
VREF_B_M2C: J1.k1 ; port VREF.VREF_B_M2C

Not connected (* = marked no-connect by the designer): J1 a14 a15 a18 a19 a34 a35 a38 a39 b4 b5 b8 b9 b12 b13 b16 b17 b24 b25 b28 b29 b32 b33 b36 b37 b40 j39 k40

### Channels
HPC1: designators end in A; ports 3P3VAUX=POWER1.3P3VAUX_HPC1 GA0=GND GA1=GND P3V3=FMC1_P3V3 VADJ=PVADJ1
HPC2: designators end in B; ports 3P3VAUX=POWER2.3P3VAUX GA0=3P3VAUX_R GA1=GND P3V3=FMC2_P3V3 VADJ=PVADJ2

### Layout directives
differential pair: CLKS1.CLK0_M2C_N, CLKS1.CLK0_M2C_P, CLKS1.CLK1_M2C_N, CLKS1.CLK1_M2C_P, CLKS1.CLK2_BIDIR_N, CLKS1.CLK2_BIDIR_P, CLKS1.CLK3_BIDIR_N, CLKS1.CLK3_BIDIR_P, DP1.DP0_C2M_N, DP1.DP0_C2M_P, DP1.DP0_M2C_N, DP1.DP0_M2C_P, DP1.DP1_C2M_N, DP1.DP1_C2M_P, DP1.DP1_M2C_N, DP1.DP1_M2C_P, DP1.DP2_C2M_N, DP1.DP2_C2M_P, DP1.DP2_M2C_N, DP1.DP2_M2C_P, DP1.DP3_C2M_N, DP1.DP3_C2M_P, DP1.DP3_M2C_N, DP1.DP3_M2C_P, GBT1.GBTCLK0_M2C_N, GBT1.GBTCLK0_M2C_P, GBT1.GBTCLK1_M2C_N, GBT1.GBTCLK1_M2C_P, HA1.HA00_CC_N, HA1.HA00_CC_P, HA1.HA01_CC_N, HA1.HA01_CC_P, HA1.HA02_N, HA1.HA02_P, HA1.HA03_N, HA1.HA03_P, HA1.HA04_N, HA1.HA04_P, HA1.HA05_N, HA1.HA05_P, HA1.HA06_N, HA1.HA06_P, HA1.HA07_N, HA1.HA07_P, HA1.HA08_N, HA1.HA08_P, HA1.HA09_N, HA1.HA09_P, HA1.HA10_N, HA1.HA10_P, HA1.HA11_N, HA1.HA11_P, HA1.HA12_N, HA1.HA12_P, HA1.HA13_N, HA1.HA13_P, HA1.HA14_N, HA1.HA14_P, HA1.HA15_N, HA1.HA15_P, HA1.HA16_N, HA1.HA16_P, HA1.HA17_CC_N, HA1.HA17_CC_P, HA1.HA18_N, HA1.HA18_P, HA1.HA19_N, HA1.HA19_P, HA1.HA20_N, HA1.HA20_P, HA1.HA21_N, HA1.HA21_P, HA1.HA22_N, HA1.HA22_P, HA1.HA23_N, HA1.HA23_P, HB1.HB00_CC_N, HB1.HB00_CC_P, HB1.HB01_N, HB1.HB01_P, HB1.HB02_N, HB1.HB02_P, HB1.HB03_N, HB1.HB03_P, HB1.HB04_N, HB1.HB04_P, HB1.HB05_N, HB1.HB05_P, HB1.HB06_CC_N, HB1.HB06_CC_P, HB1.HB07_N, HB1.HB07_P, HB1.HB08_N, HB1.HB08_P, HB1.HB09_N, HB1.HB09_P, HB1.HB10_N, HB1.HB10_P, HB1.HB11_N, HB1.HB11_P, HB1.HB12_N, HB1.HB12_P, HB1.HB13_N, HB1.HB13_P, HB1.HB14_N, HB1.HB14_P, HB1.HB15_N, HB1.HB15_P, HB1.HB16_N, HB1.HB16_P, HB1.HB17_CC_N, HB1.HB17_CC_P, HB1.HB18_N, HB1.HB18_P, HB1.HB19_N, HB1.HB19_P, HB1.HB20_N, HB1.HB20_P, HB1.HB21_N, HB1.HB21_P, LA1.LA00_CC_N, LA1.LA00_CC_P, LA1.LA01_CC_N, LA1.LA01_CC_P, LA1.LA02_N, LA1.LA02_P, LA1.LA03_N, LA1.LA03_P, LA1.LA04_N, LA1.LA04_P, LA1.LA05_N, LA1.LA05_P, LA1.LA06_N, LA1.LA06_P, LA1.LA07_N, LA1.LA07_P, LA1.LA08_N, LA1.LA08_P, LA1.LA09_N, LA1.LA09_P, LA1.LA10_N, LA1.LA10_P, LA1.LA11_N, LA1.LA11_P, LA1.LA12_N, LA1.LA12_P, LA1.LA13_N, LA1.LA13_P, LA1.LA14_N, LA1.LA14_P, LA1.LA15_N, LA1.LA15_P, LA1.LA16_N, LA1.LA16_P, LA1.LA17_CC_N, LA1.LA17_CC_P, LA1.LA18_CC_N, LA1.LA18_CC_P, LA1.LA19_N, LA1.LA19_P, LA1.LA20_N, LA1.LA20_P, LA1.LA21_N, LA1.LA21_P, LA1.LA22_N, LA1.LA22_P, LA1.LA23_N, LA1.LA23_P, LA1.LA24_N, LA1.LA24_P, LA1.LA25_N, LA1.LA25_P, LA1.LA26_N, LA1.LA26_P, LA1.LA27_N, LA1.LA27_P, LA1.LA28_N, LA1.LA28_P, LA1.LA29_N, LA1.LA29_P, LA1.LA30_N, LA1.LA30_P, LA1.LA31_N, LA1.LA31_P, LA1.LA32_N, LA1.LA32_P, LA1.LA33_N, LA1.LA33_P

### Notes on the sheet
- DP8_M2C_P
- DP9_M2C_P
- DP9_M2C_N
- DP7_M2C_P
- DP7_M2C_N
- DP8_M2C_N
- DP4_M2C_P
- DP4_M2C_N
- DP5_M2C_P
- DP6_M2C_P
- DP6_M2C_N
- DP5_M2C_N
- DP8_C2M_P
- DP9_C2M_P
- DP9_C2M_N
- DP7_C2M_P
- DP7_C2M_N
- DP8_C2M_N
- DP4_C2M_P
- DP4_C2M_N
- DP5_C2M_P
- DP6_C2M_P
- DP6_C2M_N
- DP5_C2M_N
- RES0
- VIO_B_M2C
- VAdj is not defined as power supply and therefore as global signal as it might differ for the 2 FMC mezzanines.
- Copyright LNLS 2012.
  This documentation describes Open Hardware and is licensed under the CERN OHL v.1.1. You may redistribute and modify this documentation under the terms of the CERN OHL v.1.1. (http://ohwr.org/CERNOHL). This documentation is distributed WITHOUT ANY EXPRESS OR IMPLIED WARRANTY, INCLUDING OF MERCHANTABILITY, SATISFACTORY QUALITY AND FITNESS FOR A PARTICULAR PURPOSE. Please see the CERN OHL v.1.1 for applicable conditions.

### Library data of the parts
B1-B4 = PLATED_HOLE2.7_PAD5.0: Single Terminal Socket; Part Description: Plated Through Hole: Hole Dia.=2.7mm Pad Dia.=5.0mm; Mounted: No; Table: Pads; Part Number: PLATED_HOLE2.7_PAD5.0; Component Kind: Standard (No BOM); Component Type: Standard (No BOM); Pin Count: 1; Family: Plated Hole; Socket: No; SMD: No; Status: None; ComponentHeight: 0mm; Author: CERN DEM JMW; CreateDate: 2011-09-27; LatestRevisionDate: 2011-09-27; PackageDescription: Plated Through Hole: Hole Dia.=2.7mm Pad Dia.=5.0mm
C1 C5 C7 C12 = CAP_SMD_1206: Capacitor SMD; Supplier 1: Newark; Supplier Part Number 1: 90R7810
C2 C3 C8 C9 C13 C14 C16 C17 = CAP_SMD_0603: Capacitor SMD; Supplier 1: Digi-Key; Supplier Part Number 1: 490-1524-2-ND
C4 C6 C10 C11 C15 = Ceramic_0201: MiscInfo: Biggest Cern Footprint [max height]; Document Name: FMC_connector.SchDoc; Part Number: Ceramic_0201; FootprintSizeX (mm): 1.5; FootprintSizeY (mm): 0.7; FootprintRectangleArea (mm): 1.05; Thickness (Max) (mm): 0.33; FootprintAlias: 0201
J1 = SAMTEC_ASP-134486-01: Connector VITA 57, 400 Female contacts in 10 row abcdefghj; Part Description: 400 contacts (10 rows abcdefghj) Surface Mount Female Connector, VITA 57; Manufacturer: SAMTEC; Part Number: SAMTEC_ASP-134486-01; Component Kind: Standard; Component Type: Standard; Pin Count: 400; Family: VITA 57; Mounted: Yes; Socket: No; SMD: Yes; Status: None; Manufacturer Part Number: ASP-134486-01; ComponentHeight: 6.55mm; HelpURL: \\cern.ch\dfs\Applications\Altium\Datasheets\SAMTEC_ASP-134486-01.pdf; Author: CERN DEM JLC; CreateDate: 30/04/2009; LatestRevisionDate: 17/08/2009; Table: SAMTEC

## Sheet FPGA.SchDoc
size A3; DocumentNumber: 4; SheetNumber: 4; SheetTotal: 30
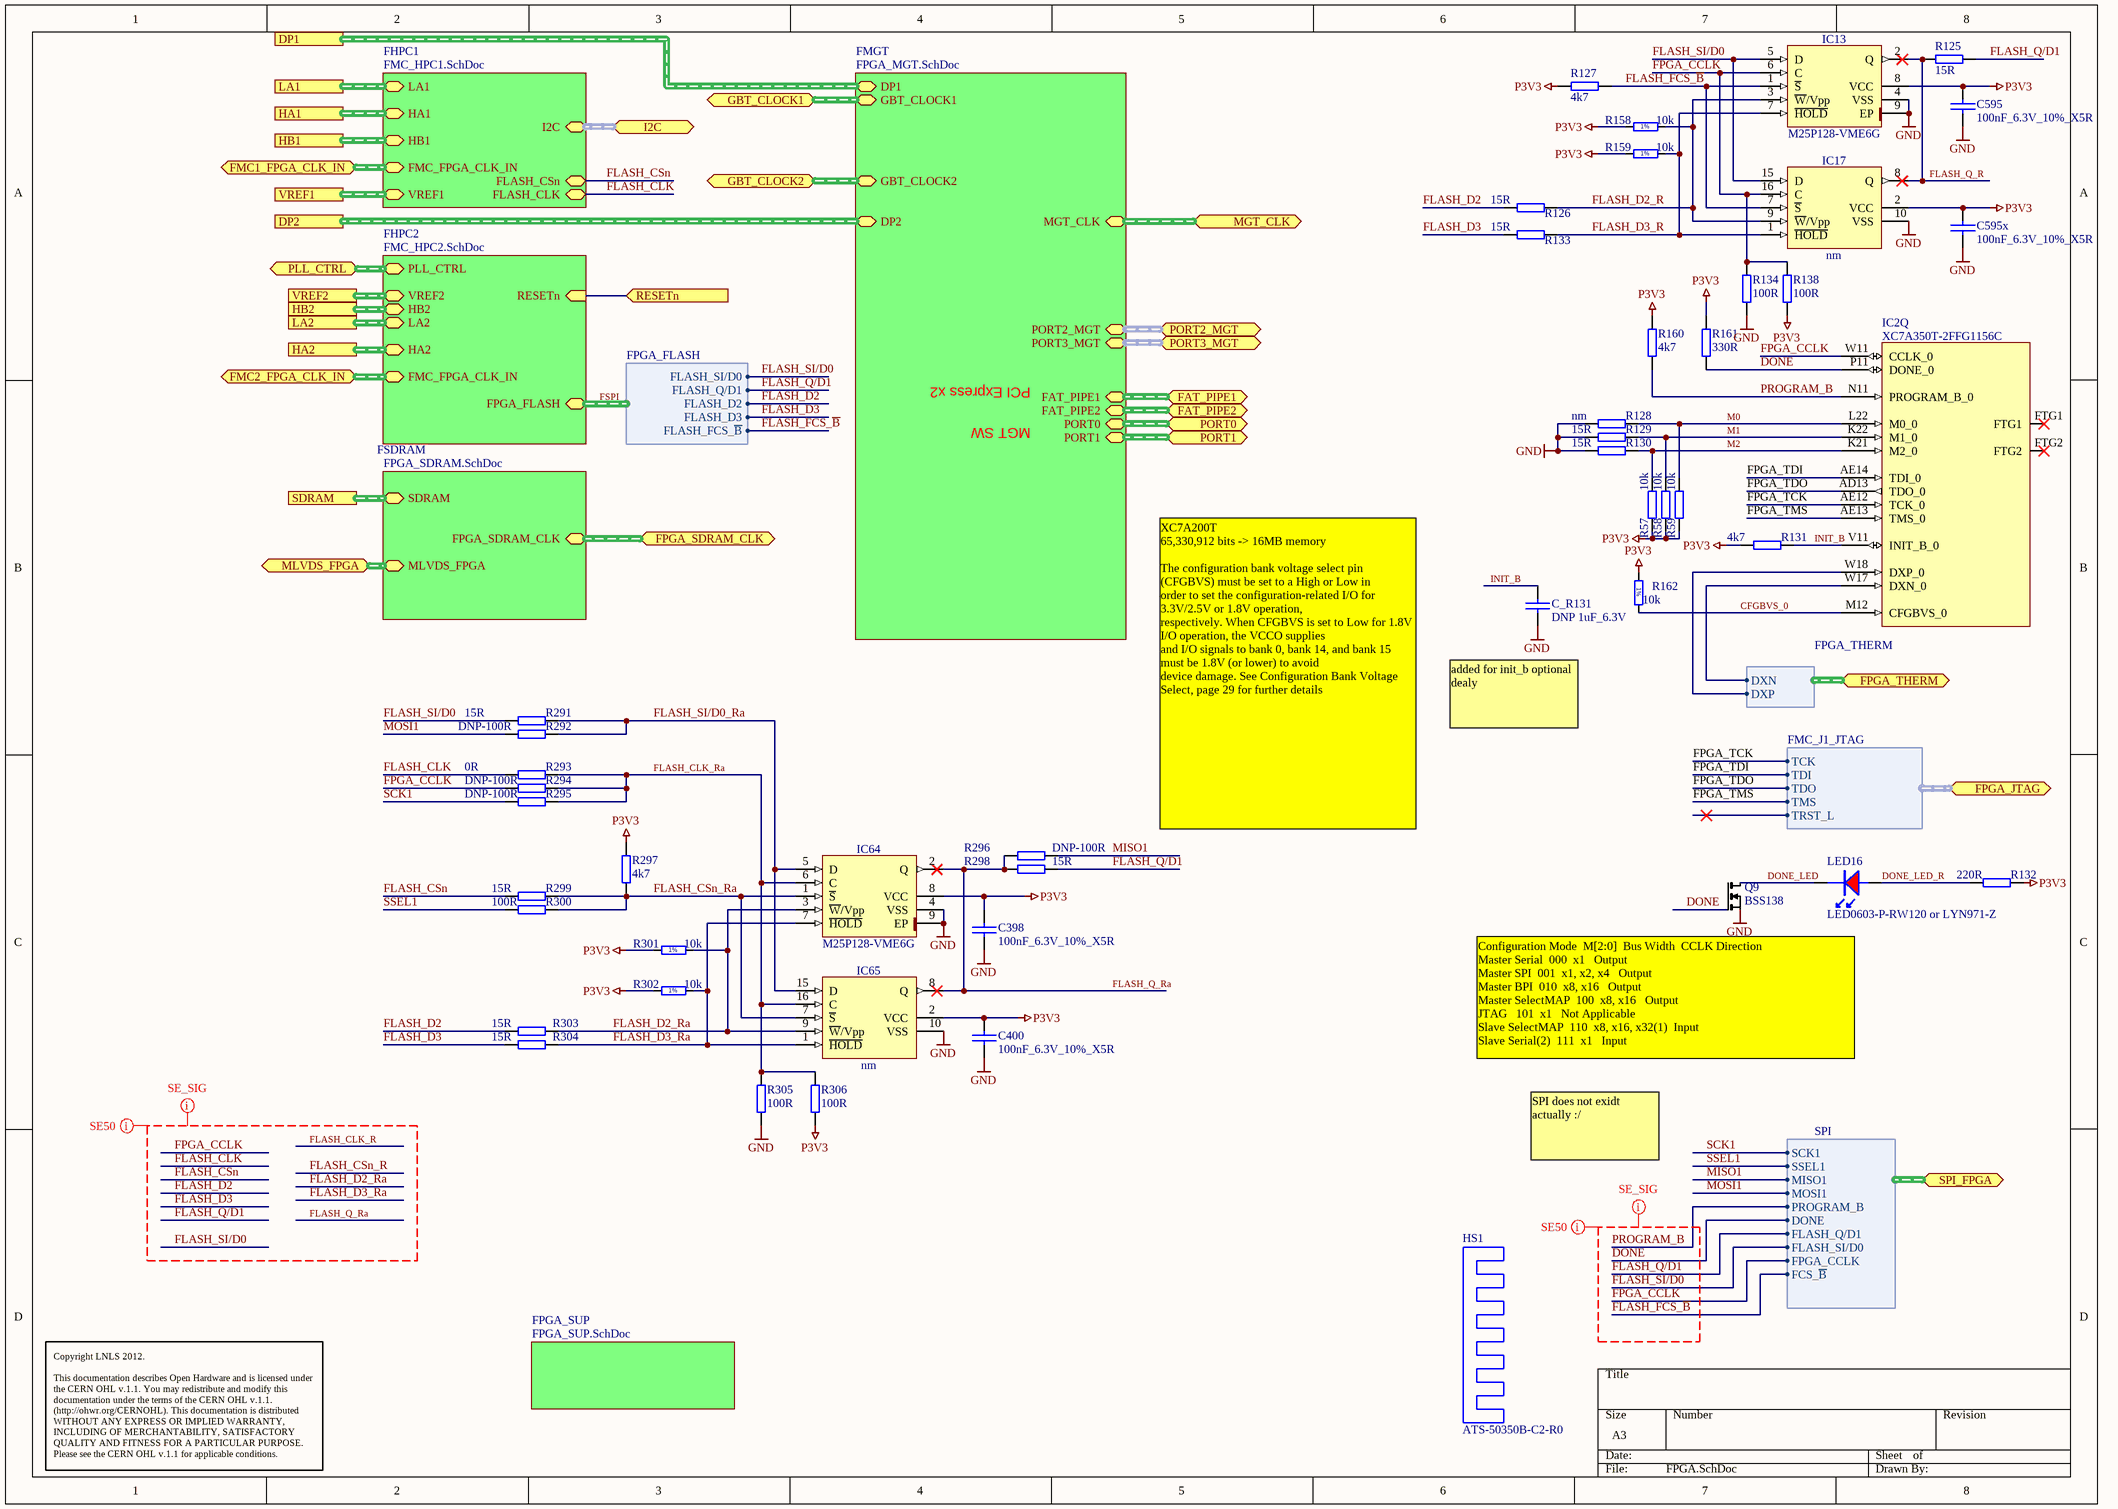
[diagram p3: FPGA.SchDoc]

### Parts
C398  100nF_6.3V_10%_X5R  [0201C]
C400  100nF_6.3V_10%_X5R  [0201C]
C595  100nF_6.3V_10%_X5R  [0201C]
C595x  100nF_6.3V_10%_X5R  [0201C]
C_R131  DNP 1uF_6.3V  [0603C]
HS1  ATS-50350B-C2-R0  [HEAT_SINK_ATS-50350B-C2-R0]
IC2  XC7A350T-2FFG1156C  [BGA1156C100P34X34_3500X3500X335]  (part Q of 23)
IC13  M25P128-VME6G  [PSON127P800X600X100-9N-R640X480]
IC17  nm  [SOIC127P1030X265-16N]
IC64  M25P128-VME6G  [PSON127P800X600X100-9N-R640X480]
IC65  nm  [SOIC127P1030X265-16N]
LED16  LED0603-P-RW120 or LYN971-Z  [led_0603R]
Q9  BSS138  [SOT-23]
R57  10k  [0402R]
R58  10k  [0402R]
R59  10k  [0402R]
R125  15R  [0402R]
R126  15R  [0402R]
R127  4k7  [0402R]
R128  nm  [0402R]
R129  15R  [0402R]
R130  15R  [0402R]
R131  4k7  [0402R]
R132  220R  [0402R]
R133  15R  [0402R]
R134  100R  [0402R]
R138  100R  [0402R]
R158  10k  [0402R]
R159  10k  [0402R]
R160  4k7  [0402R]
R161  330R  [0402R]
R162  10k  [0402R]
R291  15R  [0402R]
R292  DNP-100R  [0402R]
R293  0R  [0402R]
R294  DNP-100R  [0402R]
R295  DNP-100R  [0402R]
R296  DNP-100R  [0402R]
R297  4k7  [0402R]
R298  15R  [0402R]
R299  15R  [0402R]
R300  100R  [0402R]
R301  10k  [0402R]
R302  10k  [0402R]
R303  15R  [0402R]
R304  15R  [0402R]
R305  100R  [0402R]
R306  100R  [0402R]

### Sub-sheets
FHPC1 = FMC_HPC1.SchDoc: LA1 (harness FMC_J1_LA), HA1 (harness FMC_J1_HA), HB1 (harness FMC_J1_HB), VREF1 (harness FMC_J1_VREF), FMC_FPGA_CLK_IN (harness FMC_FPGA_CLK_IN), I2C (harness I2C), FLASH_CLK, FLASH_CSn
FHPC2 = FMC_HPC2.SchDoc: VREF2 (harness FMC_J1_VREF), HB2 (harness FMC_J1_HB), LA2 (harness FMC_J1_LA), HA2 (harness FMC_J1_HA), FPGA_FLASH (harness FPGA_FLASH), FMC_FPGA_CLK_IN (harness FMC_FPGA_CLK_IN), PLL_CTRL (harness PLL_CTRL), RESETn (in)
FMGT = FPGA_MGT.SchDoc: DP1 (harness FMC_J1_DP), DP2 (harness FMC_J1_DP), FAT_PIPE1 (harness FAT_PIPE1), FAT_PIPE2 (harness FAT_PIPE2), PORT0 (harness PORT0), PORT1 (harness PORT1), GBT_CLOCK1 (harness GBT_CLOCK), GBT_CLOCK2 (harness GBT_CLOCK), MGT_CLK (harness MGT_CLK), PORT2_MGT, PORT3_MGT
FPGA_SUP = FPGA_SUP.SchDoc: no entries
FSDRAM = FPGA_SDRAM.SchDoc: SDRAM (harness DDR), MLVDS_FPGA (harness MLVDS-FPGA), FPGA_SDRAM_CLK (harness FPGA_SDRAM_CLK)

### Ports
DP1, DP2, FAT_PIPE1, FAT_PIPE2, FMC1_FPGA_CLK_IN, FMC2_FPGA_CLK_IN, FPGA_JTAG (harness FMC_J1_JTAG), FPGA_SDRAM_CLK, FPGA_THERM (harness FPGA_THERM), GBT_CLOCK1, GBT_CLOCK2, HA1, HA2, HB1, HB2, I2C (harness I2C), LA1, LA2, MGT_CLK, MLVDS_FPGA, PLL_CTRL (harness PLL_CTRL), PORT0, PORT1, PORT2_MGT (harness PORT2), PORT3_MGT (harness PORT3), RESETn (in), SDRAM (harness DDR), SPI_FPGA (harness SPI), VREF1 (harness FMC_J1_VREF), VREF2 (harness FMC_J1_VREF)

### Harnesses
FMC_J1_JTAG: TCK, TDI, TDO, TMS, TRST_L
FPGA_THERM: DXN, DXP
SPI: SCK1, SSEL1, MISO1, MOSI1, FLASH_Q/D1, FLASH_SI/D0, PROGRAM_B, DONE, FPGA_CCLK, FCS_~{B}
FPGA_FLASH: FLASH_FCS_~{B}, FLASH_D3, FLASH_D2, FLASH_Q/D1, FLASH_SI/D0

### Nets
GND: C398.2 C400.2 C595.2 C595x.2 C_R131.1 IC13.4(VSS) IC13.9(EP) IC17.10(VSS) IC64.4(VSS) IC64.9(EP) IC65.10(VSS) Q9.2(S) R128.1 R129.1 R130.1 R134.1 R305.1
P3V3: C398.1 C400.1 C595.1 C595x.1 IC13.8(VCC) IC17.2(VCC) IC64.8(VCC) IC65.2(VCC) R57.1 R58.1 R59.1 R127.2 R131.1 R132.2 R138.1 R158.1 R159.1 R160.2 R161.2 R162.1 R297.2 R301.1 R302.1 R306.1
CFGBVS_0: IC2.M12(CFGBVS_0) R162.2
DONE: IC2.P11(DONE_0) Q9.1(G) R161.1 ; port SPI_FPGA.DONE  [project net FSPI.DONE]
DONE_LED: LED16.K Q9.3(D)
DONE_LED_R: LED16.A R132.1
FLASH_CLK: R293.1 ; sheet FHPC1/FLASH_CLK
FLASH_CLK_Ra: IC64.6(C) IC65.16(C) R293.2 R294.2 R295.2 R305.2 R306.2
FLASH_CSn: R299.1 ; sheet FHPC1/FLASH_CSn
FLASH_CSn_Ra: IC64.1(~{S}) IC65.7(~{S}) R297.1 R299.2 R300.2
FLASH_D2: R126.1 R303.1 ; sheet FHPC2/FPGA_FLASH.FLASH_D2  [project net FSPI.FLASH_D2]
FLASH_D2_R: IC13.3(~{W}/Vpp) IC17.9(~{W}/Vpp) R126.2 R158.2
FLASH_D2_Ra: IC64.3(~{W}/Vpp) IC65.9(~{W}/Vpp) R301.2 R303.2
FLASH_D3: R133.1 R304.1 ; sheet FHPC2/FPGA_FLASH.FLASH_D3  [project net FSPI.FLASH_D3]
FLASH_D3_R: IC13.7(~{HOLD}) IC17.1(~{HOLD}) R133.2 R159.2
FLASH_D3_Ra: IC64.7(~{HOLD}) IC65.1(~{HOLD}) R302.2 R304.2
FLASH_FCS_~{B}: IC13.1(~{S}) IC17.7(~{S}) R127.1 ; port SPI_FPGA.FCS_~{B}, sheet FHPC2/FPGA_FLASH.FLASH_FCS_~{B}  [project net FSPI.FCS_~{B}]
FLASH_Q/D1: R125.2 R298.2 ; port SPI_FPGA.FLASH_Q/D1, sheet FHPC2/FPGA_FLASH.FLASH_Q/D1  [project net FSPI.FLASH_Q/D1]
FLASH_Q_R: IC13.2(Q) IC17.8(Q) R125.1
FLASH_Q_Ra: IC64.2(Q) IC65.8(Q) R296.1 R298.1
FLASH_SI/D0: IC13.5(D) IC17.15(D) R291.1 ; port SPI_FPGA.FLASH_SI/D0, sheet FHPC2/FPGA_FLASH.FLASH_SI/D0  [project net FSPI.FLASH_SI/D0]
FLASH_SI/D0_Ra: IC64.5(D) IC65.15(D) R291.2 R292.2
FPGA_CCLK: IC2.W11(CCLK_0) IC13.6(C) IC17.16(C) R134.2 R138.2 R294.1 ; port SPI_FPGA.FPGA_CCLK  [project net FSPI.FPGA_CCLK]
FPGA_TCK: IC2.AE12(TCK_0) ; port FPGA_JTAG.TCK  [project net FJTAG.TCK]
FPGA_TDI: IC2.AE14(TDI_0) ; port FPGA_JTAG.TDI  [project net FJTAG.TDI]
FPGA_TDO: IC2.AD13(TDO_0) ; port FPGA_JTAG.TDO  [project net FJTAG.TDO]
FPGA_TMS: IC2.AE13(TMS_0) ; port FPGA_JTAG.TMS  [project net FJTAG.TMS]
FTMP.DXN: IC2.W17(DXN_0) ; port FPGA_THERM.DXN
FTMP.DXP: IC2.W18(DXP_0) ; port FPGA_THERM.DXP
INIT_B: C_R131.2 IC2.V11(INIT_B_0) R131.2
M0: IC2.L22(M0_0) R59.2 R128.2
M1: IC2.K22(M1_0) R58.2 R129.2
M2: IC2.K21(M2_0) R57.2 R130.2
MISO1: R296.2 ; port SPI_FPGA.MISO1  [project net FSPI.MISO1]
MOSI1: R292.1 ; port SPI_FPGA.MOSI1  [project net FSPI.MOSI1]
PROGRAM_B: IC2.N11(PROGRAM_B_0) R160.1 ; port SPI_FPGA.PROGRAM_B  [project net FSPI.PROGRAM_B]
RESETn: port RESETn, sheet FHPC2/RESETn
SCK1: R295.1 ; port SPI_FPGA.SCK1  [project net FSPI.SCK1]
SSEL1: R300.1 ; port SPI_FPGA.SSEL1  [project net FSPI.SSEL1]

Not connected (* = marked no-connect by the designer): IC2 FTG1* FTG2*

### Buses and harness runs
harness FSPI = sheet FHPC2/FPGA_FLASH
harness port DP1 = sheet FMGT/DP1
harness port DP2 = sheet FMGT/DP2
harness port FAT_PIPE1 = sheet FMGT/FAT_PIPE1
harness port FAT_PIPE2 = sheet FMGT/FAT_PIPE2
harness port FMC1_FPGA_CLK_IN = sheet FHPC1/FMC_FPGA_CLK_IN
harness port FMC2_FPGA_CLK_IN = sheet FHPC2/FMC_FPGA_CLK_IN
harness port FPGA_SDRAM_CLK = sheet FSDRAM/FPGA_SDRAM_CLK
harness port GBT_CLOCK1 = sheet FMGT/GBT_CLOCK1
harness port GBT_CLOCK2 = sheet FMGT/GBT_CLOCK2
harness port HA1 = sheet FHPC1/HA1
harness port HA2 = sheet FHPC2/HA2
harness port HB1 = sheet FHPC1/HB1
harness port HB2 = sheet FHPC2/HB2
harness port I2C = sheet FHPC1/I2C
harness port LA1 = sheet FHPC1/LA1
harness port LA2 = sheet FHPC2/LA2
harness port MGT_CLK = sheet FMGT/MGT_CLK
harness port MLVDS_FPGA = sheet FSDRAM/MLVDS_FPGA
harness port PLL_CTRL = sheet FHPC2/PLL_CTRL
harness port PORT0 = sheet FMGT/PORT0
harness port PORT1 = sheet FMGT/PORT1
harness port PORT2_MGT = sheet FMGT/PORT2_MGT
harness port PORT3_MGT = sheet FMGT/PORT3_MGT
harness port SDRAM = sheet FSDRAM/SDRAM
harness port VREF1 = sheet FHPC1/VREF1
harness port VREF2 = sheet FHPC2/VREF2

### Layout directives
net class SE_SIG: DONE, FLASH_CLK, FLASH_CLK_R, FLASH_CSn, FLASH_CSn_R, FLASH_D2, FLASH_D2_Ra, FLASH_D3, FLASH_D3_Ra, FLASH_FCS_~{B}, FLASH_Q/D1, FLASH_Q_Ra, FLASH_SI/D0, FPGA_CCLK, PROGRAM_B
net class SE50: DONE, FLASH_CLK, FLASH_CLK_R, FLASH_CSn, FLASH_CSn_R, FLASH_D2, FLASH_D2_Ra, FLASH_D3, FLASH_D3_Ra, FLASH_FCS_~{B}, FLASH_Q/D1, FLASH_Q_Ra, FLASH_SI/D0, FPGA_CCLK, PROGRAM_B

### Notes on the sheet
- PCI Express x2
- MGT SW
- (near C_R131) added for init_b optional dealy
- XC7A200T
  65,330,912 bits -> 16MB memory
  The configuration bank voltage select pin (CFGBVS) must be set to a High or Low in
  order to set the configuration-related I/O for 3.3V/2.5V or 1.8V operation,
  respectively. When CFGBVS is set to Low for 1.8V I/O operation, the VCCO supplies
  and I/O signals to bank 0, bank 14, and bank 15 must be 1.8V (or lower) to avoid
  device damage. See Configuration Bank Voltage Select, page 29 for further details
- (near Q9) Configuration Mode 	M[2:0] 	Bus Width 	CCLK Direction
  Master Serial 	000 	x1 		Output
  Master SPI 	001 	x1, x2, x4 		Output
  Master BPI 	010 	x8, x16 		Output
  Master SelectMAP 	100 	x8, x16 		Output
  JTAG 		101 	x1 		Not Applicable
  Slave SelectMAP 	110	 x8, x16, x32(1) 	Input
  Slave Serial(2) 	111 	x1 		Input
- SPI does not exidt actually :/
- Copyright LNLS 2012.
  This documentation describes Open Hardware and is licensed under the CERN OHL v.1.1. You may redistribute and modify this documentation under the terms of the CERN OHL v.1.1. (http://ohwr.org/CERNOHL). This documentation is distributed WITHOUT ANY EXPRESS OR IMPLIED WARRANTY, INCLUDING OF MERCHANTABILITY, SATISFACTORY QUALITY AND FITNESS FOR A PARTICULAR PURPOSE. Please see the CERN OHL v.1.1 for applicable conditions.
- (in symbol R0603_10K_1%_0.1W_100PPM) 1%

### Library data of the parts
C398 C400 C595 C595x = CAP_SMD_0201: Capacitor SMD
C_R131 = CAP_SMD_0603: Capacitor SMD
HS1 = HEAT_SINK_ATS-50350B-C2-R0: Heat sink BGA 35x35(44.9)mm
IC2 = XC7A350T-2FFG1156C: Artix-6 FPGA, 16 GTPs, 600 User I/Os, 1156-Pin BGA, Speed Grade 2, Commercial Grade, Pb-Free; Part Description: Artix-7 FPGA, 16 GTPs, 600 User I/Os, 1156-Pin BGA, Speed Grade 2, Commercial Grade, Pb-Free; Manufacturer: XILINX; Table: Logic; Part Number: XC7A350T-2FFG1156C; Component Kind: Standard; Component Type: Standard; Device: XC7A350T-2FFG1156C; PackageDescription: BGA, 1.00mm Pitch, Square; 1156 Pin, 34 Columns X 34 Rows, 35.00mm X 35.00mm X 3.350mm H; Manufacturer Part Number: XC7A350T-2FFG1156C; Pin Count: 1156; Case: BGA1156; Mounted: Yes; Socket: No; SMD: Yes; ComponentHeight: 3.35mm; HelpURL: \\cern.ch\dfs\Applications\Altium\Datasheets\XC7A350T-2FFG1156C.pdf; ComponentLink1URL: \\cern.ch\dfs\Applications\Altium\Datasheets\XC7A350T-2FFG1156C.pdf; ComponentLink1Description: Package/Pinout; Author: CERN DEM JLC; CreateDate: 2012-09-19; LatestRevisionDate: 2012-09-19
IC13 IC64 = M25P128-VME6G: 128 Mbit (Multilevel), low-voltage, Serial Flash memory with 50-MHz SPI bus interface; Manufacturer: NUMONYX; Table: Logic; Part Number: M25P128-VME6G; Component Kind: Standard; Component Type: Standard; Device: M25P128-VME6G; PackageDescription: SON,1.27mm,pitch; 8 pin,8.00mm W X 6.00mm L X 1.00mm H body (w/pullback leads,thermal tab 6.4 X 4.8mm), IPC Medium Density; Part Description: 128 Mbit (Multilevel), Low-Voltage, Serial Flash Memory With 50-MHz SPI Bus Interface; Manufacturer Part Number: M25P128-VME6G; Pin Count: 9; Case: SON8; Mounted: Yes; Socket: No; SMD: Yes; ComponentHeight: 1mm; HelpURL: \\cern.ch\dfs\Applications\Altium\Datasheets\M25P128-VME6G.pdf; Author: CERN DEM JLC; CreateDate: 2010-01-20; LatestRevisionDate: 2010-01-20
IC17 IC65 = M25P128-VMF6G: 128 Mbit (Multilevel), low-voltage, Serial Flash memory with 50-MHz SPI bus interface; Manufacturer: NUMONYX; Table: Logic; Part Number: M25P128-VMF6G; Component Kind: Standard; Component Type: Standard; Device: M25P128-VMF6G; PackageDescription: SOIC 16, Pitch 1.27mm - Body 7.5x10.3mm, IPC Medium Density; Part Description: 128 Mbit (Multilevel), Low-Voltage, Serial Flash Memory With 50-MHz SPI Bus Interface; Manufacturer Part Number: M25P128-VMF6G; Pin Count: 8; Case: SOIC16; Mounted: Yes; Socket: No; SMD: Yes; ComponentHeight: 2.65mm; HelpURL: \\cern.ch\dfs\Applications\Altium\Datasheets\M25P128-VMF6G.pdf; Author: CERN DEM JLC; CreateDate: 2010-01-20; LatestRevisionDate: 2010-10-21
LED16 = LED_0603R: LED 0603 red; Supplier 1: Newark; Supplier Part Number 1: 22M3004; Supplier 2: Newark; Supplier Part Number 2: 20M0618
Q9 = Q_BSS138
R57-R59 R125-R134 R138 R160 R161 R291-R300 R303-R306 = RES_0402: SMD Resistor; Supplier 1: Newark; Supplier Part Number 1: 59M6691
R158 R159 R162 R301 R302 = R0603_10K_1%_0.1W_100PPM: Resistor - 1%; Part Description: General Purpose Thick Film Chip Resistor; Manufacturer: GENERIC; Manufacturer1 Part Number: NRC06F1002TRF; Power: 0.1W; TC: ±100ppm/°C; Table: Resistors SMD; Part Number: R0603_10K_1%_0.1W_100PPM; Component Kind: Standard; Component Type: Standard; Footprint: RESC1608X55N; Pin Count: 2; Value: 10k; Status: Preferred; Tolerance: ±1%; Manufacturer Part Number: R0603_10K_1%_0.1W_100PPM; Case: 0603; Mounted: Yes; Socket: No; SMD: Yes; Manufacturer1 Example: NIC COMPONENT; Manufacturer1 ComponentHeight: 0.55mm; HelpURL: \\cern.ch\dfs\Applications\Altium\Datasheets\R0603_NIC_NRC.pdf; Author: CERN DEM JLC; CreateDate: 2007-12-03; LatestRevisionDate: 2008-03-13